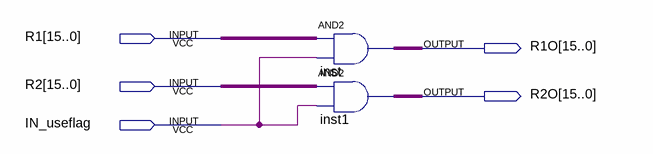
[diagram p0: schematic sheet]
// Quartus schematic regALUSelector.bdf as structural Verilog: 2 symbols, 5 pins
module regALUSelector (
  input  [15:0] R1,
  input  [15:0] R2,
  input  IN_useflag,
  output [15:0] R1O,
  output [15:0] R2O
);

  assign R1O = R1 & {16{IN_useflag}};  // AND2 inst, 16 bits wide
  assign R2O = R2 & {16{IN_useflag}};  // AND2 inst1, 16 bits wide
endmodule
